# EAGLE design mega pinout (4) (EAGLE 9.2.2)
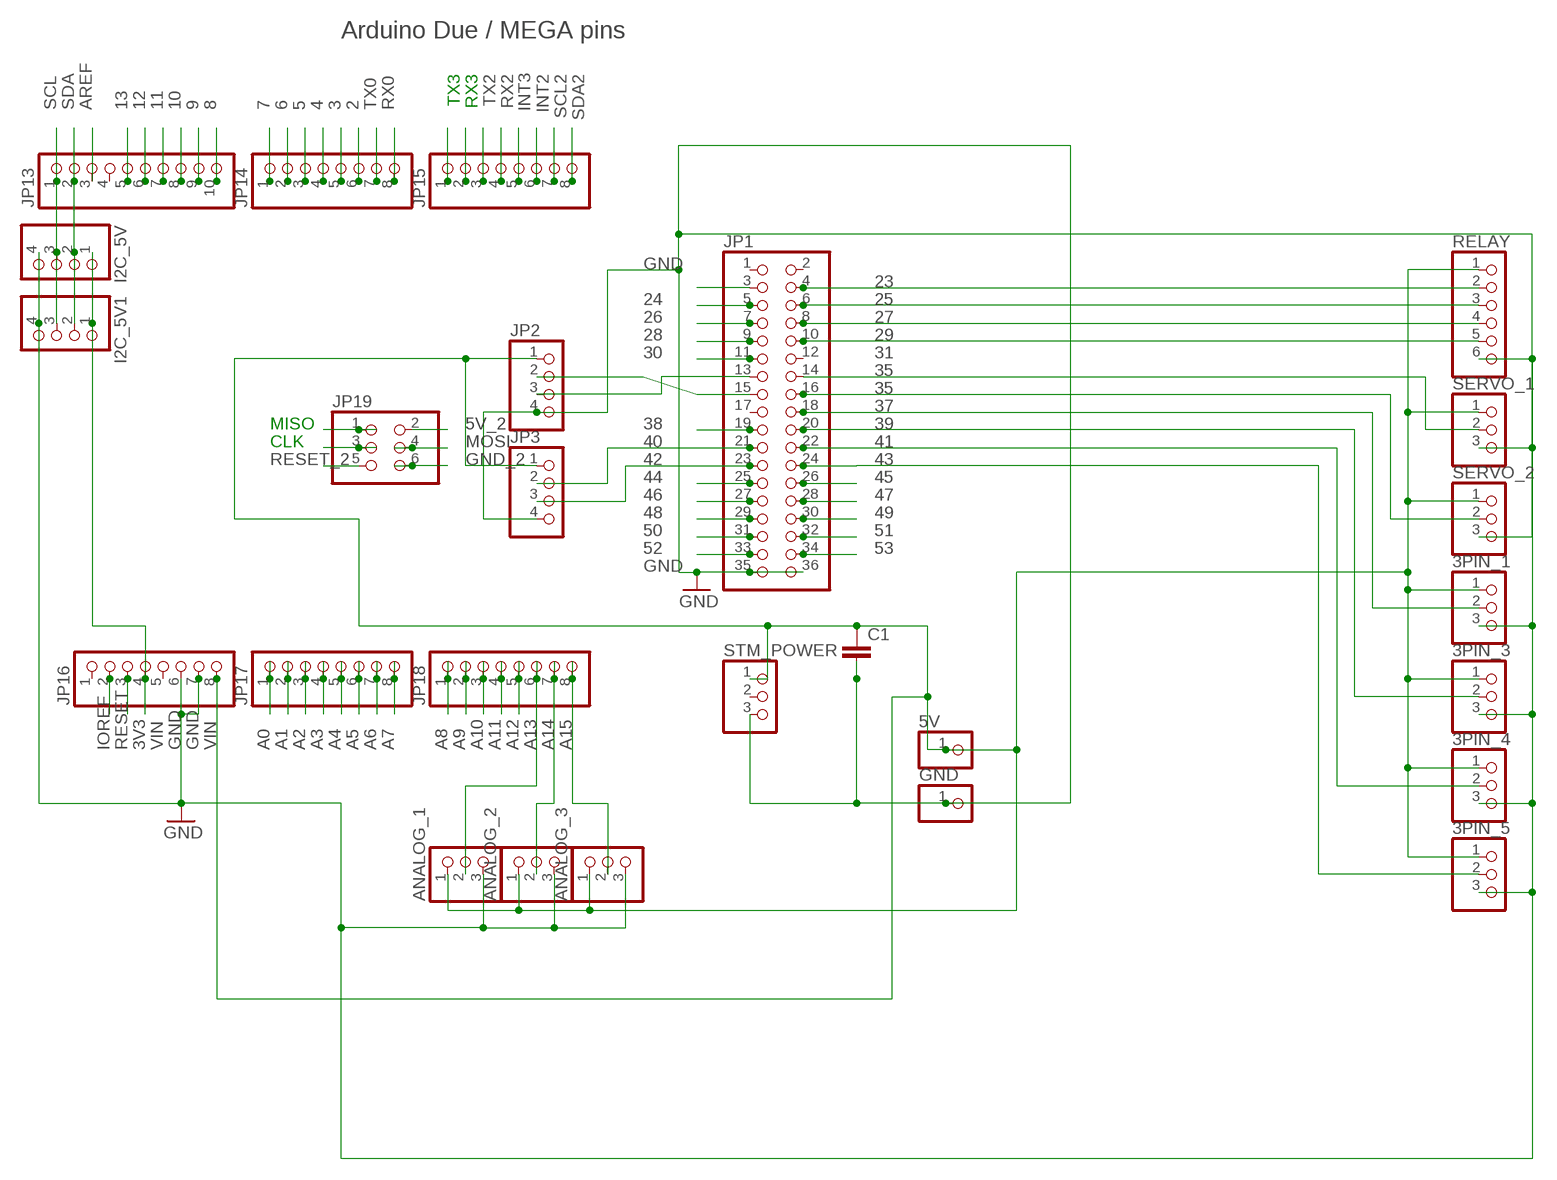
[diagram p0: schematic, sheet 1]

## Parts
3PIN_1  PINHD-1X3  [1X03]
3PIN_3  PINHD-1X3  [1X03]
3PIN_4  PINHD-1X3  [1X03]
3PIN_5  PINHD-1X3  [1X03]
5V  PINHD-1X1  [1X01]
ANALOG_1  PINHD-1X3  [1X03]
ANALOG_2  PINHD-1X3  [1X03]
ANALOG_3  PINHD-1X3  [1X03]
C1  C-EU075-032X103  [C075-032X103]
GND  PINHD-1X1  [1X01]
I2C_5V  PINHD-1X4  [1X04]
I2C_5V1  PINHD-1X4  [1X04]
JP1  PINHD-2X18  [2X18]
JP2  PINHD-1X4  [1X04]
JP3  PINHD-1X4  [1X04]
JP13  PINHD-1X10  [1X10]
JP14  PINHD-1X8  [1X08]
JP15  PINHD-1X8  [1X08]
JP16  PINHD-1X8  [1X08]
JP17  PINHD-1X8  [1X08]
JP18  PINHD-1X8  [1X08]
JP19  PINHD-2X3  [2X03]
RELAY  PINHD-1X6  [1X06]
SERVO_1  PINHD-1X3  [1X03]
SERVO_2  PINHD-1X3  [1X03]
STM_POWER  PINHD-1X3  [1X03]

## Nets
2: JP14.6
3: JP14.5
3V3: I2C_5V1.1 I2C_5V.1 JP16.4
4: JP14.4
5: JP14.3
5V_2: JP19.2
6: JP14.2
7: JP14.1
8: JP13.10
9: JP13.9
10: JP13.8
11: JP13.7
12: JP13.6
13: JP13.5
23: JP1.4 RELAY.2
24: JP1.5
25: JP1.6 RELAY.3
26: JP1.7
27: JP1.8 RELAY.4
28: JP1.9
29: JP1.10 RELAY.5
30: JP1.11
31: JP1.14 SERVO_1.2
35: JP1.16 SERVO_2.2
37: 3PIN_1.2 JP1.18
38: JP1.19
39: 3PIN_3.2 JP1.20
40: JP1.21 JP3.2
41: 3PIN_4.2 JP1.22
42: JP1.23 JP3.3
43: 3PIN_5.2 JP1.24
44: JP1.25
45: JP1.26
46: JP1.27
47: JP1.28
48: JP1.29
49: JP1.30
50: JP1.31
51: JP1.32
52: JP1.33
53: JP1.34
A0: JP17.1
A1: JP17.2
A2: JP17.3
A3: JP17.4
A4: JP17.5
A5: JP17.6
A6: JP17.7
A7: JP17.8
A8: JP18.1
A9: JP18.2
A10: JP18.3
A11: JP18.4
A12: JP18.5
A13: ANALOG_1.2 JP18.6
A14: ANALOG_2.2 JP18.7
A15: ANALOG_3.2 JP18.8
AREF: JP13.3
CLK: JP19.3
GND: 3PIN_1.3 3PIN_3.3 3PIN_4.3 3PIN_5.3 ANALOG_1.3 ANALOG_2.3 ANALOG_3.3 C1.2 GND.1 I2C_5V1.4 I2C_5V.4 JP1.35 JP1.36 JP2.4 JP3.4 JP16.6 JP16.7 RELAY.6 SERVO_1.3 SERVO_2.3 STM_POWER.3
GND_2: JP19.6
INT2: JP15.6
INT3: JP15.5
IOREF: JP16.2
MISO: JP19.1
MOSI: JP19.4
N$1: JP1.3
N$2: JP1.15 JP2.2
N$3: JP1.13 JP2.3
RESET: JP16.3
RESET_2: JP19.5
RX0: JP14.8
RX2: JP15.4
RX3: JP15.2
SCL: I2C_5V1.3 I2C_5V.3 JP13.1
SCL2: JP15.7
SDA: I2C_5V1.2 I2C_5V.2 JP13.2
SDA2: JP15.8
TX0: JP14.7
TX2: JP15.3
TX3: JP15.1
VIN: 3PIN_1.1 3PIN_3.1 3PIN_4.1 3PIN_5.1 5V.1 ANALOG_1.1 ANALOG_2.1 ANALOG_3.1 C1.1 JP2.1 JP3.1 JP16.8 RELAY.1 SERVO_1.1 SERVO_2.1 STM_POWER.1
Unconnected: JP1.1 JP1.2 JP1.12 JP1.17 JP13.4 JP16.1 JP16.5 STM_POWER.2

## Notes on the sheet
- Arduino Due / MEGA pins

## Library data of the parts
3PIN_1 3PIN_3-3PIN_5 ANALOG_1-ANALOG_3 SERVO_1 SERVO_2 STM_POWER = pinhead:PINHD-1X3: PIN HEADER
5V GND = pinhead:PINHD-1X1: PIN HEADER
C1 = resistor:C-EU: CAPACITOR, European symbol
I2C_5V I2C_5V1 JP2 JP3 = pinhead:PINHD-1X4: PIN HEADER
JP1 = pinhead:PINHD-2X18: PIN HEADER
JP13 = pinhead:PINHD-1X10: PIN HEADER
JP14-JP18 = pinhead:PINHD-1X8: PIN HEADER
JP19 = pinhead:PINHD-2X3: PIN HEADER
RELAY = pinhead:PINHD-1X6: PIN HEADER

## Net classes
1 vcc: width 0.305 mm

## Board
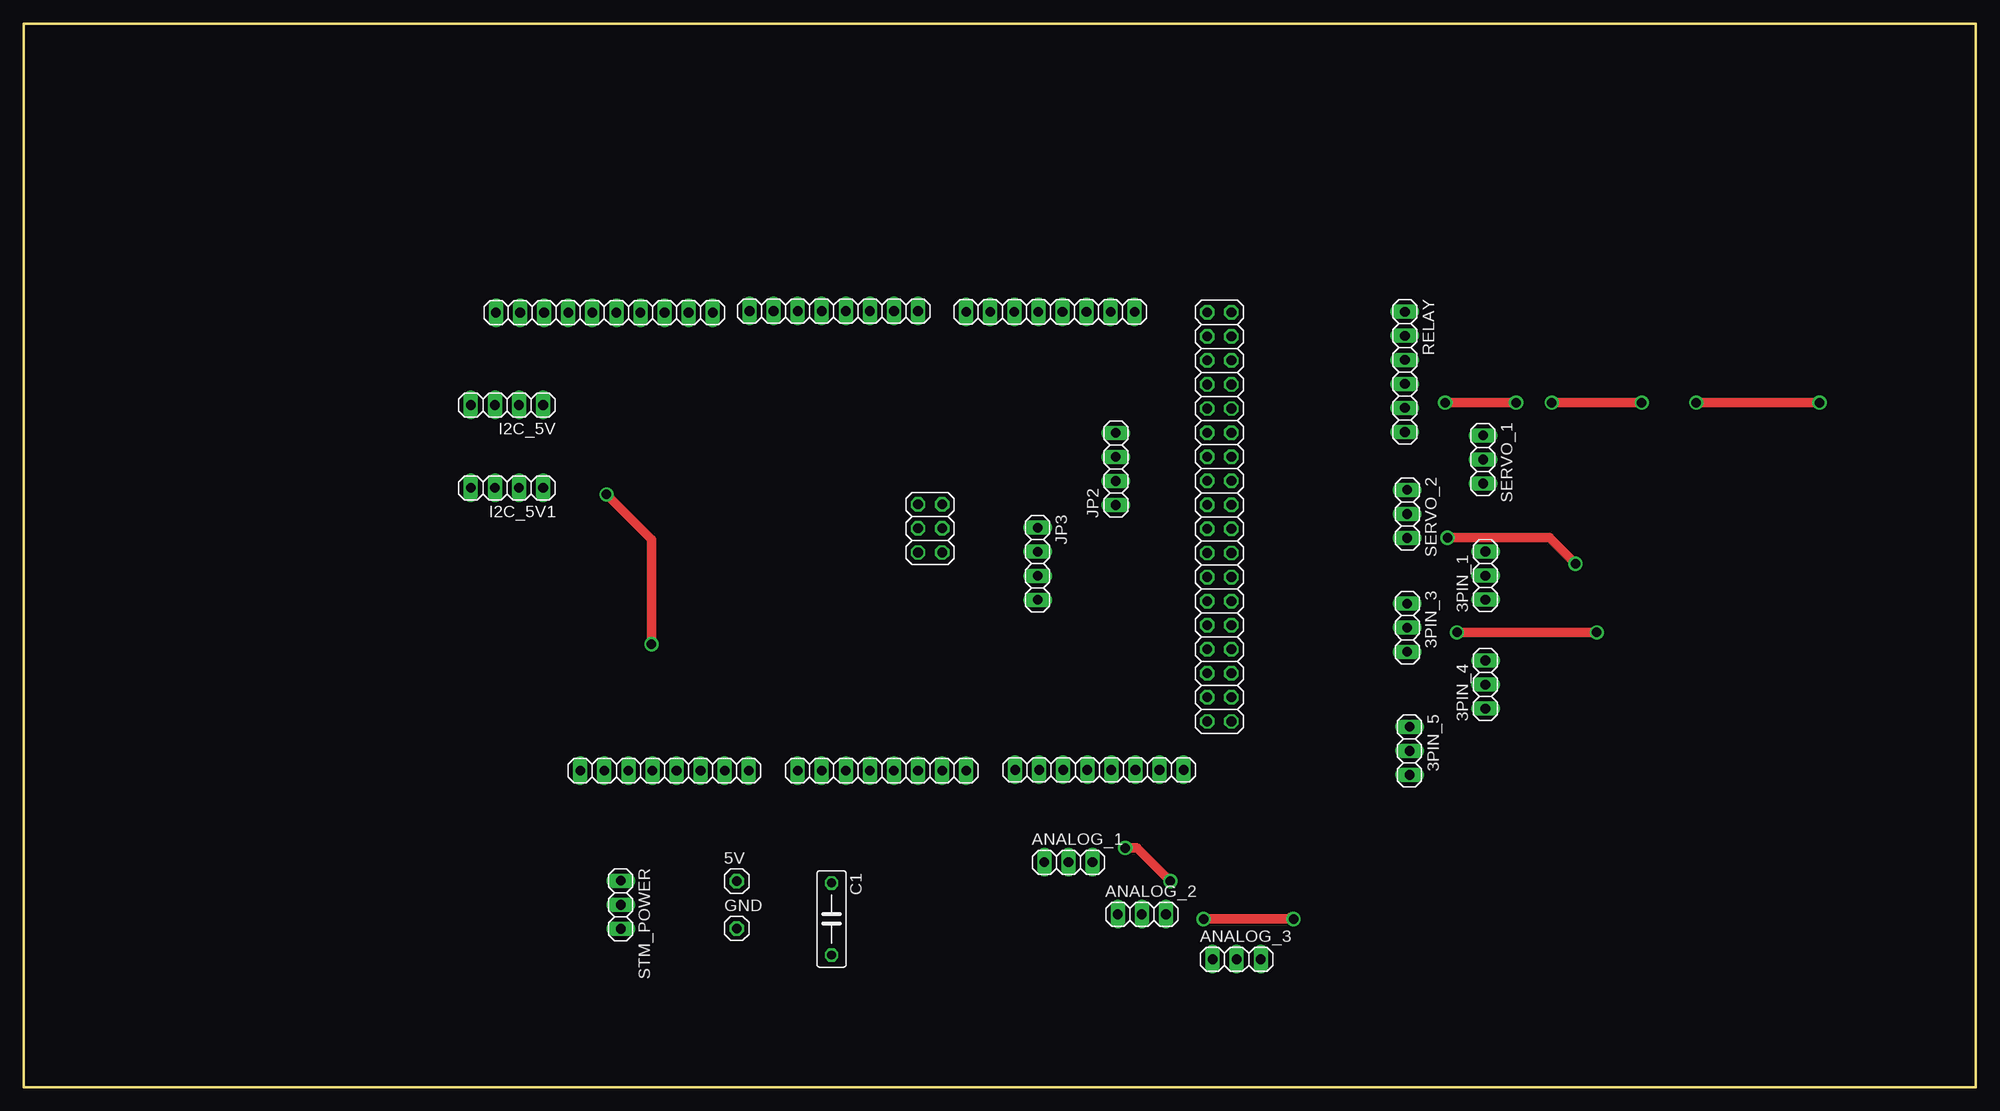
[diagram p1: board, top side]
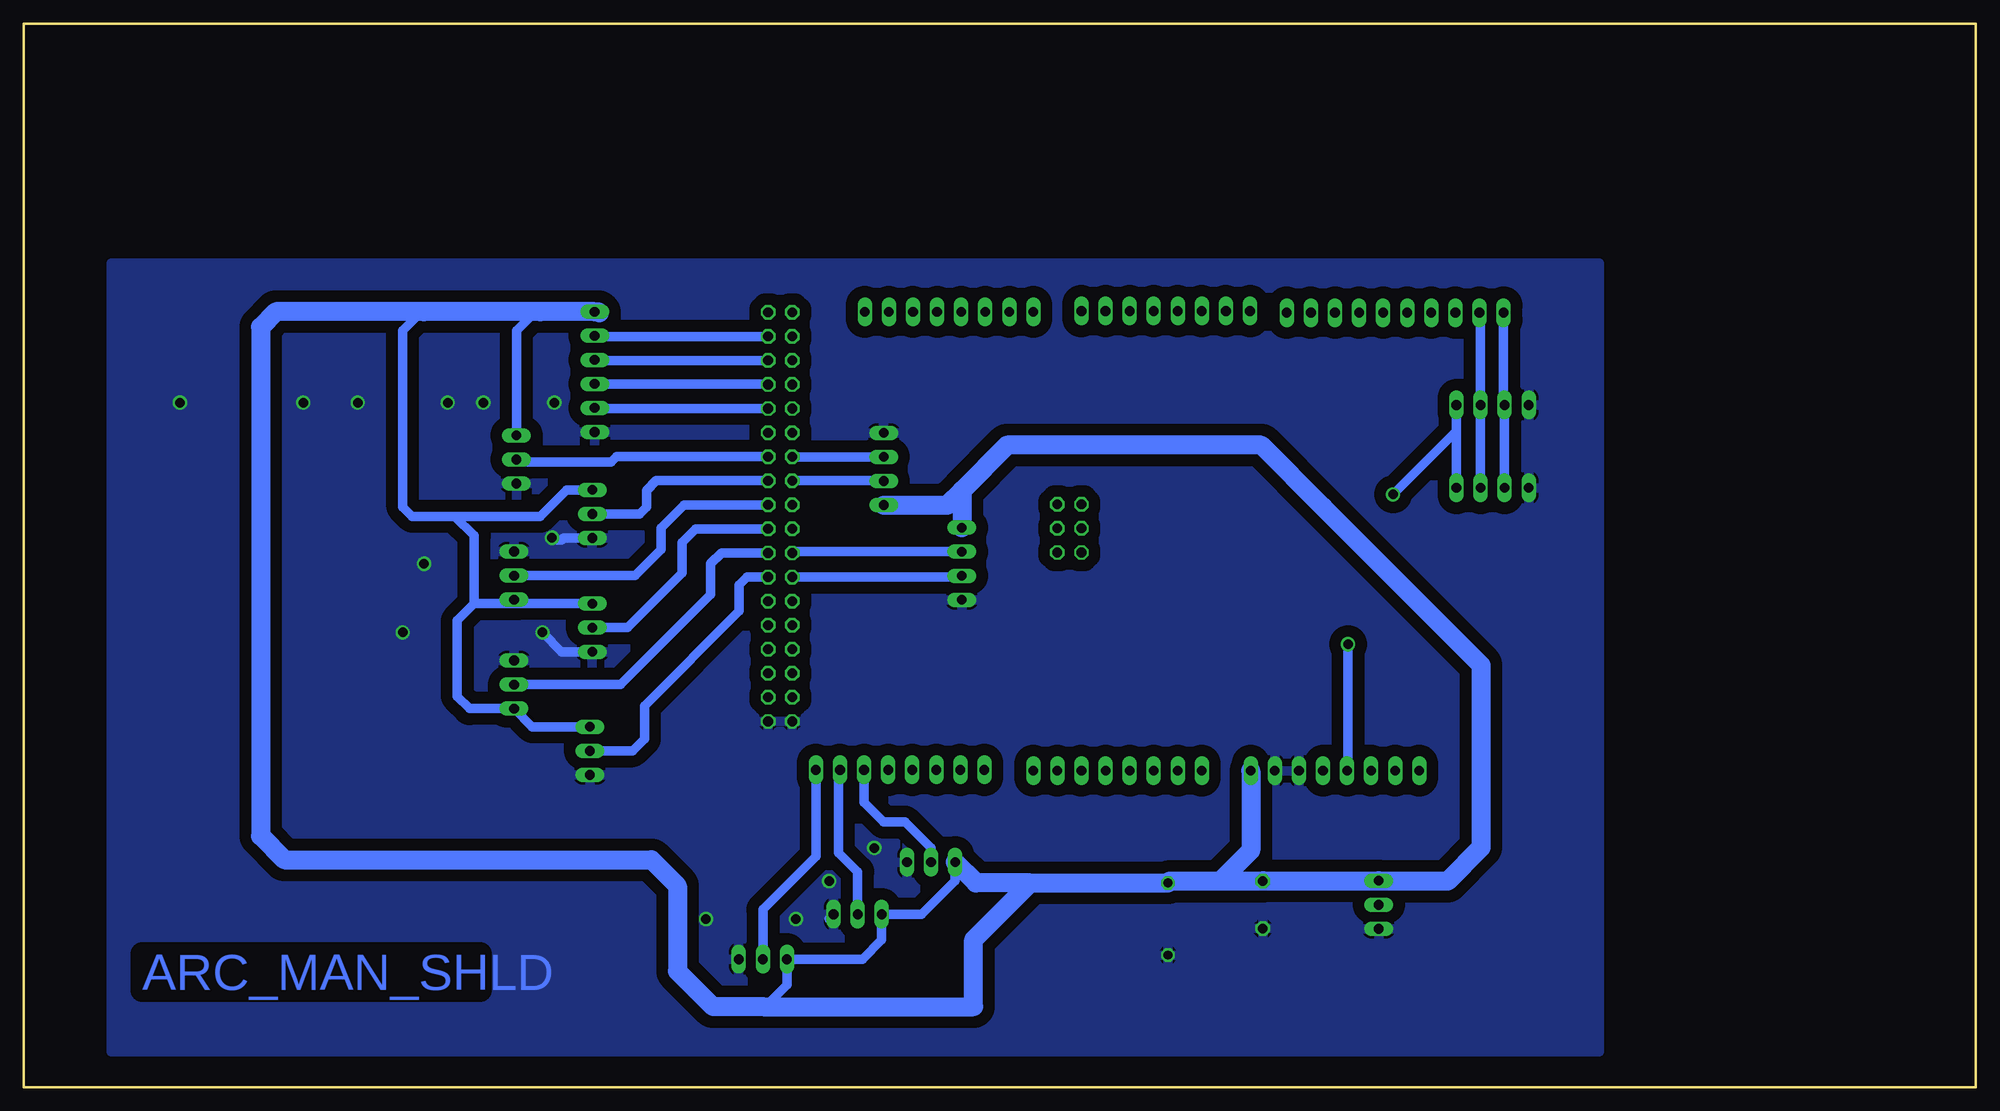
[diagram p2: board, bottom side, seen from below]

Size 206 x 112.25 mm. Coordinates in mm from the lower left corner, seen from the top.
Outline: 0,0 206,0 206,112.25 0,112.25 0,0
Copper layers (1*16): Top 0.035mm / dielectric 1.5mm / Bottom 0.035mm
Design rules "default": minimum track width 10mil, minimum drill 24mil, track to track 8mil, track to pad 8mil, pad to pad 8mil, via to via 8mil, smd to smd 8mil, copper to edge 40mil, drill to drill 8mil, minimum pad ring 10mil, minimum via ring 8mil, stop-mask expansion 4mil, vias tented up to drill 0mil, thermal gap 10mil

### Footprints (pad centres in the part's own frame; a part is rotated, then mirrored left to right if it is on the bottom)
1X03 = drill 1.016 long: 1 -2.54,0; 2 0,0; 3 2.54,0
1X01 = drill 1.016 octagon: 1 0,0
C075-032X103 = drill 0.914 octagon: 1 -3.81,0; 2 3.81,0
1X04 = drill 1.016 long: 1 -3.81,0; 2 -1.27,0; 3 1.27,0; 4 3.81,0
2X18 = drill 1.016 octagon: 1 -21.59,-1.27; 2 -21.59,1.27; 3 -19.05,-1.27; 4 -19.05,1.27; 5 -16.51,-1.27; 6 -16.51,1.27; 7 -13.97,-1.27; 8 -13.97,1.27; 9 -11.43,-1.27; 10 -11.43,1.27; 11 -8.89,-1.27; 12 -8.89,1.27; 13 -6.35,-1.27; 14 -6.35,1.27; 15 -3.81,-1.27; 16 -3.81,1.27; 17 -1.27,-1.27; 18 -1.27,1.27; 19 1.27,-1.27; 20 1.27,1.27; 21 3.81,-1.27; 22 3.81,1.27; 23 6.35,-1.27; 24 6.35,1.27; 25 8.89,-1.27; 26 8.89,1.27; 27 11.43,-1.27; 28 11.43,1.27; 29 13.97,-1.27; 30 13.97,1.27; 31 16.51,-1.27; 32 16.51,1.27; 33 19.05,-1.27; 34 19.05,1.27; 35 21.59,-1.27; 36 21.59,1.27
1X10 = drill 1.016 long: 1 -11.43,0; 2 -8.89,0; 3 -6.35,0; 4 -3.81,0; 5 -1.27,0; 6 1.27,0; 7 3.81,0; 8 6.35,0; 9 8.89,0; 10 11.43,0
1X08 = drill 1.016 long: 1 -8.89,0; 2 -6.35,0; 3 -3.81,0; 4 -1.27,0; 5 1.27,0; 6 3.81,0; 7 6.35,0; 8 8.89,0
2X03 = drill 1.016 octagon: 1 -2.54,-1.27; 2 -2.54,1.27; 3 0,-1.27; 4 0,1.27; 5 2.54,-1.27; 6 2.54,1.27
1X06 = drill 1.016 long: 1 -6.35,0; 2 -3.81,0; 3 -1.27,0; 4 1.27,0; 5 3.81,0; 6 6.35,0

### Placement (x,y rotation side)
3PIN_1  154.25,54 90 top
3PIN_3  146,48.5 270 top
3PIN_4  154.25,42.5 90 top
3PIN_5  146.25,35.5 270 top
5V  75.25,21.75 0 top
ANALOG_1  110.25,23.75 0 top
ANALOG_2  118,18.25 0 top
ANALOG_3  128,13.5 0 top
C1  85.25,17.75 270 top
GND  75.25,16.75 0 top
I2C_5V  51,72 180 top
I2C_5V1  51,63.25 180 top
JP1  126.17,60.19 270 top
JP2  115.25,65.25 90 top
JP3  107,55.25 270 top
JP13  61.27,81.75 0 top
JP14  85.49,81.92 0 top
JP15  108.34,81.83 0 top
JP16  67.62,33.41 0 top
JP17  90.57,33.41 0 top
JP18  113.51,33.49 0 top
JP19  95.65,58.98 90 top
RELAY  145.75,75.5 270 top
SERVO_1  154,66.25 270 top
SERVO_2  146,60.5 270 top
STM_POWER  63,19.25 270 top

### Tracks (layer width: path | path; a pad name or v marks a point on that pad's centre or on a via)
3V3  (via drill 1 pad 1.3)
  Top 1.016: v61.5,62.56 66.25,57.81 v66.25,46.75
  Bottom 1.016: I2C_5V1.1 54.81,69.25 | 54.81,69.25 I2C_5V.1 | 54.81,69.25 v61.5,62.56 61.5,62.5 | v66.25,46.75 66.25,33.51 JP16.4
23
  Bottom 1.016: JP1.4 145.69,79.25 RELAY.2
25
  Bottom 1.016: JP1.6 145.69,76.7 RELAY.3
27
  Bottom 1.016: RELAY.4 127.51,74.23 JP1.8
29
  Bottom 1.016: JP1.10 145.69,71.62 RELAY.5
31
  Bottom 1.016: JP1.14 143.46,66.55 144,66 153.75,66 SERVO_1.2
35
  Bottom 1.016: JP1.16 139.25,64 140.25,63 140.25,61.25 141,60.5 SERVO_2.2
37
  Bottom 1.016: JP1.18 136.28,61.47 138.75,59 138.75,56.75 141.5,54 3PIN_1.2
39
  Bottom 1.016: 3PIN_3.2 142.25,48.5 136.5,54.25 136.5,57.5 135.07,58.92 JP1.20
40
  Bottom 1.016: JP3.2 124.77,56.52 JP1.21
41
  Bottom 1.016: JP1.22 132.37,56.38 133.5,55.25 133.5,52 143,42.5 3PIN_4.2
42
  Bottom 1.016: JP1.23 107.14,53.84 JP3.3
43
  Bottom 1.016: JP1.24 129.66,53.84 130.5,53 130.5,50.25 140.5,40.25 140.5,36.75 141.75,35.5 3PIN_5.2
A13
  Bottom 1.016: JP18.6 117.32,30.07 115.25,28 113,28 110.25,25.25 ANALOG_1.2
A14
  Bottom 1.016: ANALOG_2.2 118,22.75 120,24.75 120,33.35 JP18.7
A15
  Bottom 1.016: JP18.8 122.4,24.35 128,18.75 ANALOG_3.2
GND  (via drill 1 pad 1.3)
  Top 1.016: v176.5,72.25 v189.5,72.25 | v157.5,72.25 v150,72.25 | v121,21.75 117.5,25.25 v116.25,25.25 | v124.5,17.75 133.5,17.75 133.75,18 v134,17.75 | v161.25,72.25 v170.75,72.25 | v150.25,58 161,58 v163.75,55.25 | v151.25,48 v166,48
  Bottom 1.016: ANALOG_2.3 121.04,17.75 | SERVO_2.3 149.04,57.96 149.25,57.75 150,57.75 v150.25,58 | 3PIN_3.3 149.21,45.96 v151.25,48
  pour Bottom (isolate 1.23): 39.75,87 39.75,3.75 196.75,3.75 196.75,87
N$2
  Bottom 1.016: JP1.15 115.28,64 JP2.2
N$3
  Bottom 1.016: JP2.3 124.88,66.52 JP1.13
SCL
  Bottom 1.016: JP13.1 49.84,72.11 I2C_5V.3 I2C_5V1.3
SDA
  Bottom 1.016: JP13.2 52.27,81.64 I2C_5V.2 I2C_5V1.2
VIN
  Bottom 1.016: ANALOG_1.1 107.71,21.79 111.25,18.25 ANALOG_2.1 115.46,15.54 117.5,13.5 ANALOG_3.1 125.46,10.79 127.75,8.5 128,8.5 | RELAY.1 146,82.1 | SERVO_2.1 148.71,63.04 151.5,60.25 160.5,60.25 | 160.5,60.25 165,60.25 166,61.25 166,79.85 164,81.85 163.75,81.85 | SERVO_1.1 154,79.85 152,81.85 151.5,81.85 | 3PIN_5.1 152.33,38.04 3PIN_4.1 158.96,39.96 160.25,41.25 160.25,49.25 158.46,51.04 | 3PIN_3.1 153.83,51.04 | 153.83,51.04 3PIN_1.1 | 158.46,51.04 153.83,51.04 | 158.46,51.04 158.46,58.21 160.5,60.25 | 68.89,60.61 68.89,61.25
  Bottom 2: 79.75,21.75 5V.1 75.21,21.79 STM_POWER.1 62.96,21.75 55.75,21.75 52.21,25.29 52.21,44.57 68.89,61.25 75.39,67.75 102.25,67.75 107,63 | 79.75,21.75 85.06,21.75 C1.1 99.75,21.56 | 99.75,21.56 105.52,21.56 ANALOG_1.1 | 99.75,21.56 105.75,15.56 105.75,8.5 128,8.5 133.25,8.5 137,12.25 137,21.25 139.75,24 178.5,24 181,26.5 181,80.25 179.4,81.85 163.75,81.85 151.5,81.85 RELAY.1 145.35,81.85 145.25,81.75 | 107,63 JP3.1 | JP2.1 108.56,61.44 107,63 | JP16.8 76.51,24.99 79.75,21.75

### Text on the board
Bottom: ARC_MAN_SHLD